# Altium schematic sheet usb.SchDoc
size 447 x 332 mm
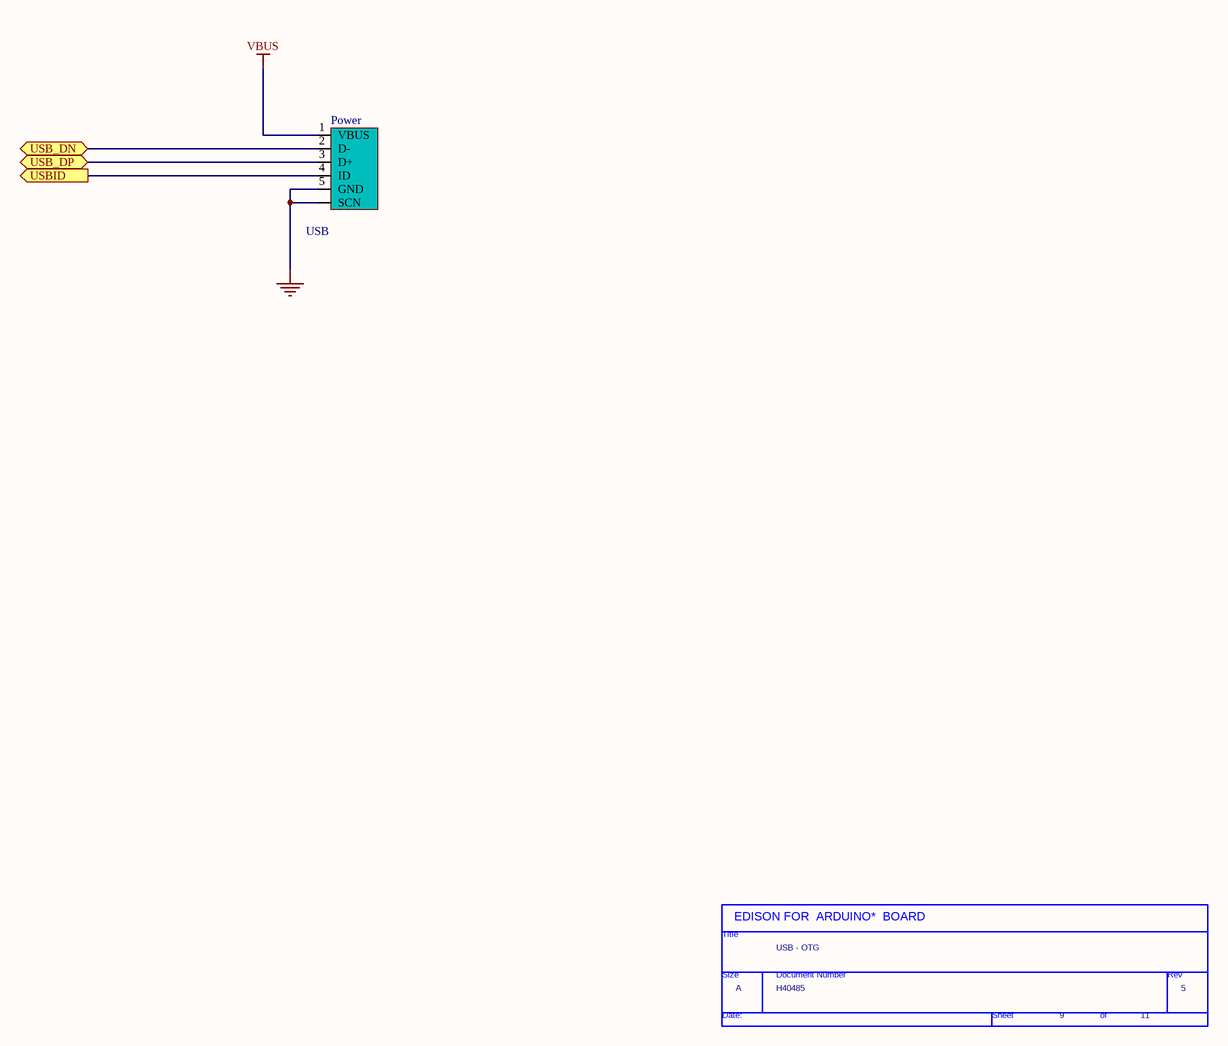
[diagram p0: usb.SchDoc]

## Parts
*  Page Count: 11  Page Number: 9  Page Size: A  Title: USB - OTG  RevCode: 5  Doc: H40485  (hidden comment: TitleBlock0)  (graphical)
Power  USB  [USB SMD]

## Ports
USB_DN (bidir), USB_DP (bidir), USBID (out)

## Nets
GND: Power.0(SCN) Power.5(GND)
VBUS: Power.1(VBUS)
USB_DN: Power.2(D-) ; port USB_DN
USB_DP: Power.3(D+) ; port USB_DP
USBID: Power.4(ID) ; port USBID

## Notes on the sheet
- (in symbol TitleBlock0) EDISON FOR  ARDUINO*  BOARD; Title; Size; Document Number; Rev; Date:; Sheet; of

## Library data of the parts
Power = USB_SMT_B: USB Type-B SMT Socket; Class: Connector; Supplier 1: Digi-Key; Supplier Part Number 1: 670-1190-1-ND
* = TitleBlock0: Page Create Date: March  8, 1995